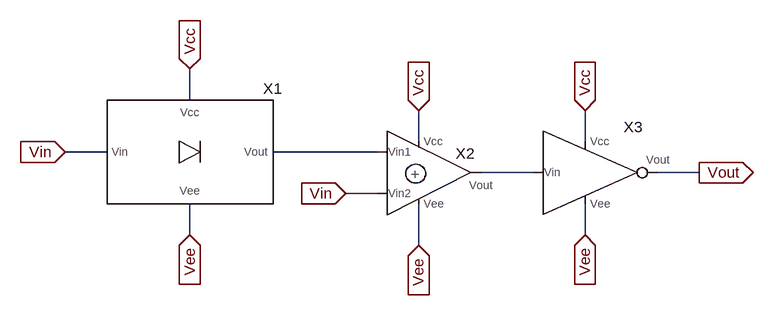
[diagram p0: schematic PraezisionsVollweggleichrichter_Variante_Addierer.asc]
PraezisionsVollweggleichrichter_Variante_Addierer.asc, the LTspice schematic file:
Version 4
SHEET 1 1296 680
WIRE 64 48 64 0
WIRE 416 112 416 64
WIRE 672 112 672 64
WIRE -64 128 -128 128
WIRE 352 128 192 128
WIRE 592 160 512 160
WIRE 848 160 784 160
WIRE 352 192 304 192
WIRE 64 256 64 208
WIRE 672 256 672 208
WIRE 416 272 416 208
FLAG 64 0 Vcc
IOPIN 64 0 In
FLAG 64 256 Vee
IOPIN 64 256 In
FLAG -128 128 Vin
IOPIN -128 128 In
FLAG 416 272 Vee
IOPIN 416 272 In
FLAG 416 64 Vcc
IOPIN 416 64 In
FLAG 304 192 Vin
IOPIN 304 192 In
FLAG 672 64 Vcc
IOPIN 672 64 In
FLAG 672 256 Vee
IOPIN 672 256 In
FLAG 848 160 Vout
IOPIN 848 160 Out
SYMBOL PraezEinwegGleichrichter 64 128 R0
SYMATTR InstName X1
SYMATTR SpiceLine k=2
SYMBOL Addierer 432 160 R0
SYMATTR InstName X2
SYMATTR SpiceLine R4V5 = 1k
SYMBOL InverterOp 672 160 R0
SYMATTR InstName X3

The netlist it stands for:
* PraezisionsVollweggleichrichter_Variante_Addierer.asc
XX1 Vcc Vee Vin N001 PraezEinwegGleichrichter k=2  ; pins Vcc Vee Vin Vout
XX2 Vcc Vee Vin N001 N002 Addierer R4V5 = 1k  ; pins Vcc Vee Vin2 Vin1 Vout
XX3 Vcc Vee N002 Vout InverterOp  ; pins Vcc Vee Vin Vout
.backanno
.end